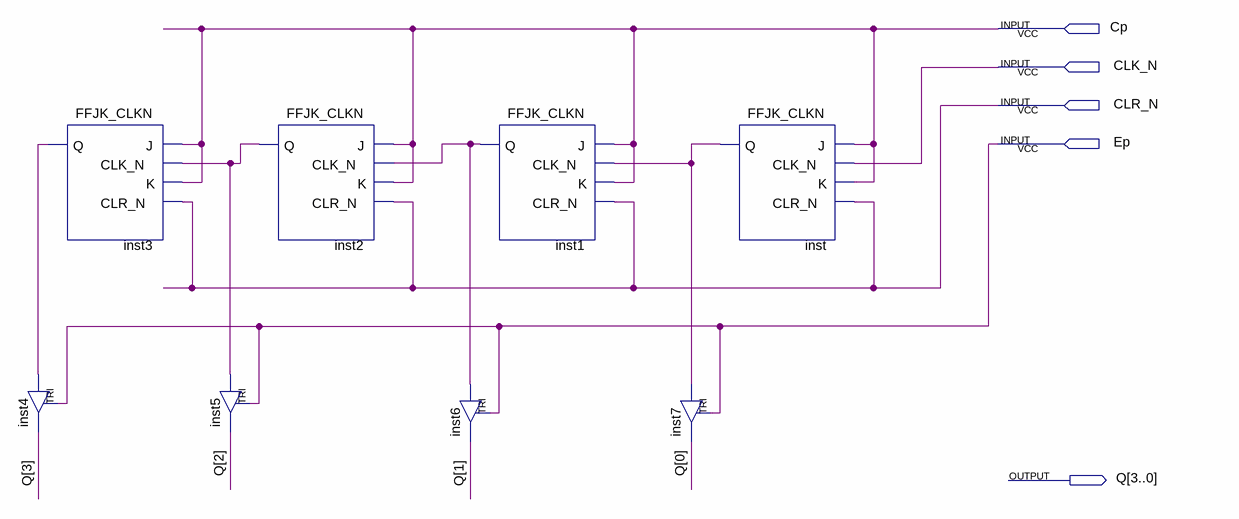
[diagram p0: schematic sheet]
// Quartus schematic PC.bdf as structural Verilog: 8 symbols, 5 pins
module PC (
  input  Cp,
  input  CLK_N,
  input  CLR_N,
  input  Ep,
  output [3:0] Q
);

  wire inst1_q, inst2_q, inst3_q, inst_q;

  FFJK_CLKN inst3 (.J(Cp), .CLK_N(inst2_q), .K(Cp), .CLR_N(CLR_N), .Q(inst3_q));
  TRI inst4 (.IN(inst3_q), .OE(Ep), .OUT(Q[3]));
  TRI inst5 (.IN(inst2_q), .OE(Ep), .OUT(Q[2]));
  FFJK_CLKN inst2 (.J(Cp), .CLK_N(inst1_q), .K(Cp), .CLR_N(CLR_N), .Q(inst2_q));
  FFJK_CLKN inst1 (.J(Cp), .CLK_N(inst_q), .K(Cp), .CLR_N(CLR_N), .Q(inst1_q));
  TRI inst6 (.IN(inst1_q), .OE(Ep), .OUT(Q[1]));
  TRI inst7 (.IN(inst_q), .OE(Ep), .OUT(Q[0]));
  FFJK_CLKN inst (.J(Cp), .CLK_N(CLK_N), .K(Cp), .CLR_N(CLR_N), .Q(inst_q));
endmodule
